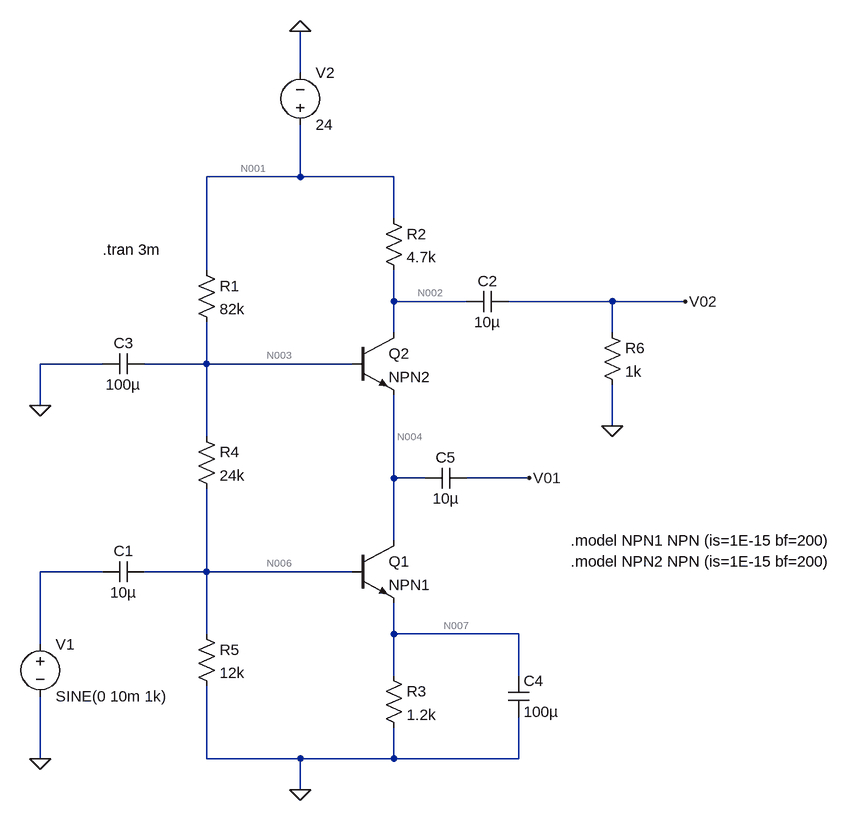
[diagram p0: schematic Cascode Amplifier (BJT).asc]
Cascode Amplifier (BJT).asc, the LTspice schematic file:
Version 4
SHEET 1 948 680
WIRE 96 -656 96 -720
WIRE 96 -496 96 -576
WIRE 96 -496 -48 -496
WIRE 240 -496 96 -496
WIRE 240 -432 240 -496
WIRE -48 -352 -48 -496
WIRE 240 -304 240 -352
WIRE 352 -304 240 -304
WIRE 576 -304 416 -304
WIRE 688 -304 576 -304
WIRE 240 -256 240 -304
WIRE 576 -256 576 -304
WIRE -208 -208 -304 -208
WIRE -48 -208 -48 -272
WIRE -48 -208 -144 -208
WIRE 176 -208 -48 -208
WIRE -304 -144 -304 -208
WIRE 576 -112 576 -176
WIRE -48 -96 -48 -208
WIRE 240 -32 240 -160
WIRE 288 -32 240 -32
WIRE 448 -32 352 -32
WIRE 240 64 240 -32
WIRE -208 112 -304 112
WIRE -48 112 -48 -16
WIRE -48 112 -144 112
WIRE 176 112 -48 112
WIRE -48 208 -48 112
WIRE 240 208 240 160
WIRE 432 208 240 208
WIRE -304 224 -304 112
WIRE 240 272 240 208
WIRE 432 272 432 208
WIRE -304 400 -304 304
WIRE -48 400 -48 288
WIRE 96 400 -48 400
WIRE 240 400 240 352
WIRE 240 400 96 400
WIRE 432 400 432 336
WIRE 432 400 240 400
WIRE 96 448 96 400
FLAG 576 -112 0
FLAG 96 448 0
FLAG -304 -144 0
FLAG 96 -720 0
FLAG -304 400 0
FLAG 448 -32 V01
FLAG 688 -304 V02
SYMBOL npn 176 64 R0
SYMATTR InstName Q1
SYMATTR Value NPN1
SYMBOL npn 176 -256 R0
SYMATTR InstName Q2
SYMATTR Value NPN2
SYMBOL res -64 -368 R0
SYMATTR InstName R1
SYMATTR Value 82k
SYMBOL res 224 -448 R0
SYMATTR InstName R2
SYMATTR Value 4.7k
SYMBOL res 224 256 R0
SYMATTR InstName R3
SYMATTR Value 1.2k
SYMBOL res -64 -112 R0
SYMATTR InstName R4
SYMATTR Value 24k
SYMBOL res -64 192 R0
SYMATTR InstName R5
SYMATTR Value 12k
SYMBOL res 560 -272 R0
SYMATTR InstName R6
SYMATTR Value 1k
SYMBOL cap -144 96 R90
WINDOW 0 0 32 VBottom 2
WINDOW 3 32 32 VTop 2
SYMATTR InstName C1
SYMATTR Value 10µ
SYMBOL cap 416 -320 R90
WINDOW 0 0 32 VBottom 2
WINDOW 3 32 32 VTop 2
SYMATTR InstName C2
SYMATTR Value 10µ
SYMBOL cap -144 -224 R90
WINDOW 0 0 32 VBottom 2
WINDOW 3 32 32 VTop 2
SYMATTR InstName C3
SYMATTR Value 100µ
SYMBOL voltage -304 208 R0
WINDOW 123 0 0 Left 0
WINDOW 39 0 0 Left 0
SYMATTR InstName V1
SYMATTR Value SINE(0 10m 1k)
SYMBOL voltage 96 -560 M180
WINDOW 0 24 96 Left 2
WINDOW 3 24 16 Left 2
SYMATTR InstName V2
SYMATTR Value 24
SYMBOL cap 416 272 R0
SYMATTR InstName C4
SYMATTR Value 100µ
SYMBOL cap 352 -48 R90
WINDOW 0 0 32 VBottom 2
WINDOW 3 32 32 VTop 2
SYMATTR InstName C5
SYMATTR Value 10µ
TEXT -208 -384 Left 2 !.tran 3m
TEXT 512 64 Left 2 !.model NPN1 NPN (is=1E-15 bf=200)
TEXT 512 96 Left 2 !.model NPN2 NPN (is=1E-15 bf=200)

The netlist it stands for:
* Cascode Amplifier (BJT).asc
Q1 N004 N006 N007 0 NPN1
Q2 N002 N003 N004 0 NPN2
R1 N001 N003 82k
R2 N001 N002 4.7k
R3 N007 0 1.2k
R4 N003 N006 24k
R5 N006 0 12k
R6 V02 0 1k
C1 N006 N005 10µ
C2 V02 N002 10µ
C3 N003 0 100µ
V1 N005 0 SINE(0 10m 1k)
V2 N001 0 24
C4 N007 0 100µ
C5 V01 N004 10µ
.model NPN NPN
.model PNP PNP
.lib standard.bjt
.tran 3m
.model NPN1 NPN (is=1E-15 bf=200)
.model NPN2 NPN (is=1E-15 bf=200)
.backanno
.end

* Results of the author's LTspice run, read from the files saved beside the schematic
* Operating Point, zero values left out:
*   V(n004) = 6.381 V
*   V(n006) = 2.315 V
*   V(n007) = 1.593 V
*   V(n002) = 17.82 V
*   V(n003) = 7.103 V
*   V(n001) = 24 V
*   V(v01) = 63.81 µV
*   Ic(Q2) = 1.314 mA
*   Ib(Q2) = 6.571 µA
*   Ie(Q2) = -1.321 mA
*   Ic(Q1) = 1.321 mA
*   Ib(Q1) = 6.604 µA
*   Ie(Q1) = -1.327 mA
*   I(R5) = 192.9 µA
*   I(R4) = 199.5 µA
*   I(R3) = 1.327 mA
*   I(R2) = 1.314 mA
*   I(R1) = 206.1 µA
*   I(V2) = -1.52 mA
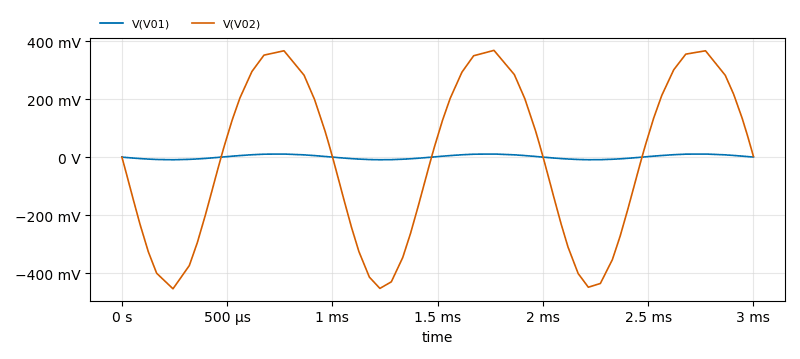
[diagram p1: Transient Analysis of Cascode Amplifier (BJT).asc, plotted from the saved traces]
* Transient Analysis, 1 run:
*   V(V01): min -9.011 mV, max 10.75 mV, average 922.6 µV, rms 7.035 mV, last 122.2 µV
*   V(V02): min -453.8 mV, max 368 mV, average -1.7 mV, rms 289 mV, last 2.511 mV